# EAGLE schematic led-sync (EAGLE 9.6.2)
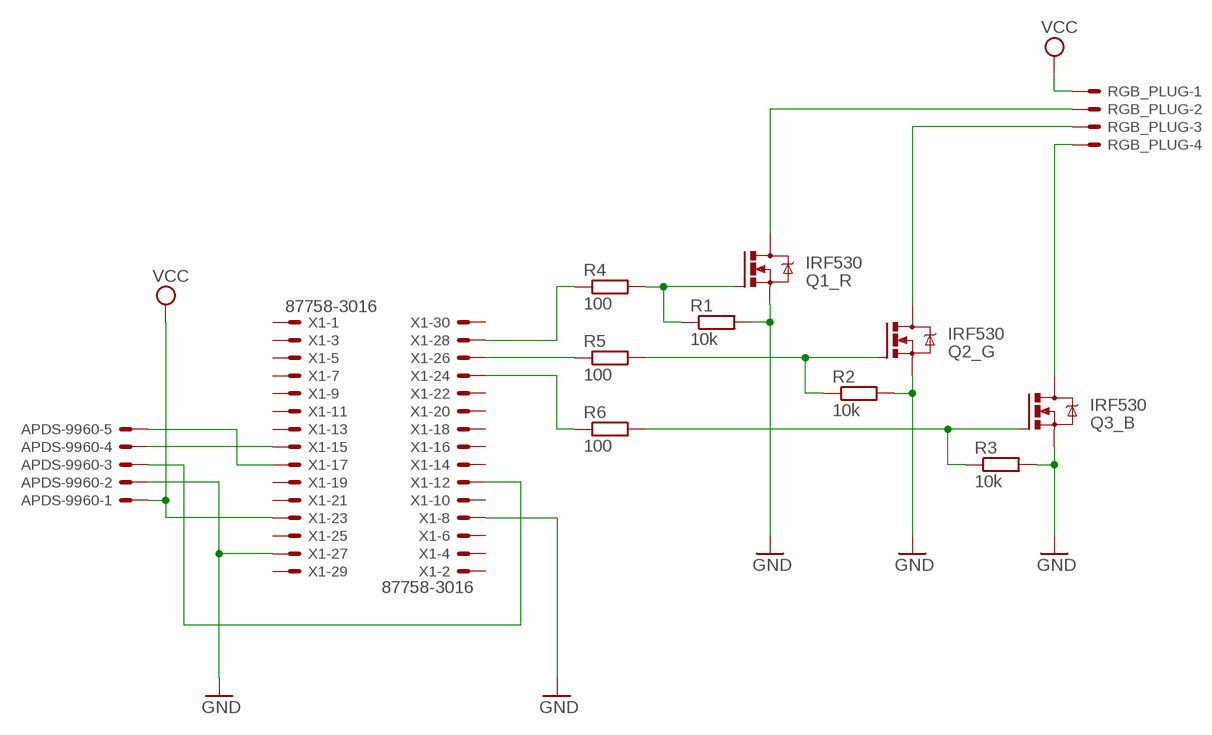
[diagram p0: schematic, sheet 1]

## Parts
APDS-9960  22-23-2051  [22-23-2051]
Q1_R  IRF530  [TO220BV]
Q2_G  IRF530  [TO220BV]
Q3_B  IRF530  [TO220BV]
R1  10k  R-EU_0207/10  [0207/10]
R2  10k  R-EU_0207/10  [0207/10]
R3  10k  R-EU_0207/10  [0207/10]
R4  100  R-EU_0207/10  [0207/10]
R5  100  R-EU_0207/10  [0207/10]
R6  100  R-EU_0207/10  [0207/10]
RGB_PLUG  22-23-2041  [22-23-2041]
X1  87758-3016  [87758-3016]

## Nets
GND: APDS-9960.2 Q1_R.S Q2_G.S Q3_B.S R1.2 R2.2 R3.2 X1.8 X1.27
N$1: Q1_R.D RGB_PLUG.2
N$2: Q2_G.D RGB_PLUG.3
N$3: Q3_B.D RGB_PLUG.4
N$4: Q2_G.G R2.1 R5.2
N$5: R4.1 X1.28
N$6: R5.1 X1.26
N$7: Q1_R.G R1.1 R4.2
N$8: R6.1 X1.24
N$9: Q3_B.G R3.1 R6.2
N$10: APDS-9960.4 X1.15
N$12: APDS-9960.3 X1.12
N$13: APDS-9960.5 X1.17
VCC: APDS-9960.1 RGB_PLUG.1 X1.23
Unconnected: X1.1 X1.2 X1.3 X1.4 X1.5 X1.6 X1.7 X1.9 X1.10 X1.11 X1.13 X1.14 X1.16 X1.18 X1.19 X1.20 X1.21 X1.22 X1.25 X1.29 X1.30

## Library data of the parts
APDS-9960 = con-molex:22-23-2051: .100" (2.54mm) Center Header - 5 Pin; MF: MOLEX; MPN: APDS-9960; OC_FARNELL: 1462952; OC_NEWARK: 38C9178
Q1_R Q2_G Q3_B = transistor-power:IRF530: HEXFET Power MOSFET
R1-R6 = rcl:R-EU_: RESISTOR, European symbol; SPICEPREFIX: R
RGB_PLUG = con-molex:22-23-2041: .100" (2.54mm) Center Header - 4 Pin; MF: MOLEX; MPN: 22-23-2041; OC_FARNELL: 1462920; OC_NEWARK: 38C0355
X1 = con-molex:87758-3016: 30 Pin - 2mm Dual Row Single Wafer, Vertical T/H HDR Source: http://www.molex.com/pdm_docs/sd/877580616_sd.pdf; MF: MOLEX; MPN: 87758-3016; OC_FARNELL: unknown; OC_NEWARK: 59J1575